# EAGLE design V2_SENSOR (EAGLE 6.4)
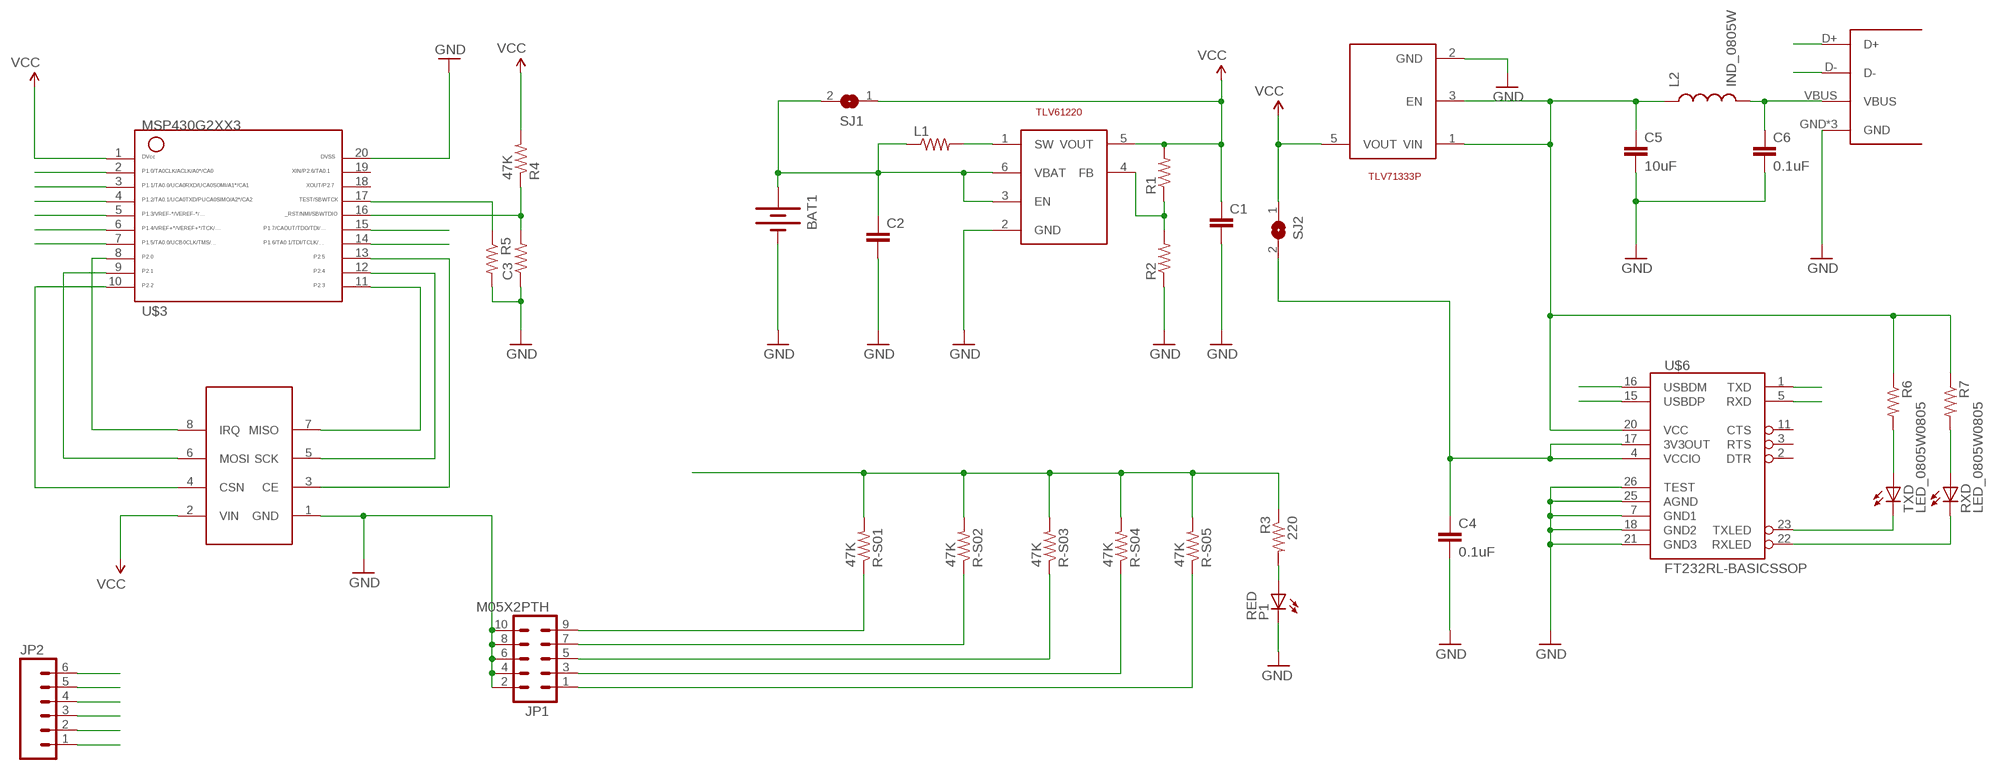
[diagram p0: schematic, sheet 1]

## Parts
BAT1  BATTERY20PTH  [BATTCOM_20MM_PTH]
C1  CAP_0805W  [0805W]
C2  CAP_0805W  [0805W]
C3  RES_0805W  [0805W]
C4  0.1uF  CAP_0805W  [0805W]
C5  10uF  CAP_0805W  [0805W]
C6  0.1uF  CAP_0805W  [0805W]
JP1  M05X2PTH  [AVR_ICSP]
JP2  M06SIP  [1X06]
JP4  USB-A-H  [USB-A-H]
L1  RES_0805W  [0805W]
L2  IND_0805W  [0805W]
P1  RED  LED_0805W0805  [0805W_LED]
R1  RES_0805W  [0805W]
R2  RES_0805W  [0805W]
R3  220  RES_0805W  [0805W]
R4  47K  RES_0805W  [0805W]
R5  RES_0805W  [0805W]
R6  RES_0805W  [0805W]
R7  RES_0805W  [0805W]
R-S01  47K  RES_0805W  [0805W]
R-S02  47K  RES_0805W  [0805W]
R-S03  47K  RES_0805W  [0805W]
R-S04  47K  RES_0805W  [0805W]
R-S05  47K  RES_0805W  [0805W]
RXD  LED_0805W0805  [0805W_LED]
SJ1  SJ  [SJ]
SJ2  SJ  [SJ]
TXD  LED_0805W0805  [0805W_LED]
U1  NRF24L01-4X2  [NRF24L01-4X2]
U$2  TLV61220  TI-TLV61220  [SOT23-6L]
U$3  G2XX3---N20  [N20]
U$5  TI-TLV71333P  [SOT23-5]
U$6  FT232RL-BASICSSOP  [SSOP28DB]

## Nets
5V: C5.1 L2.1 R6.1 R7.1 U$5.1(VIN) U$5.3(EN) U$6.20(VCC)
GND: BAT1.2(-) C1.2 C2.2 C3.1 C4.2 C5.2 C6.2 JP1.2 JP1.4 JP1.6 JP1.8 JP1.10 JP2.6 JP4.GND JP4.GND2(GND) JP4.GND3(GND) P1.C R2.1 R5.2 U1.1(GND) U$2.2(GND) U$3.20 U$5.2(GND) U$6.7(GND1) U$6.18(GND2) U$6.21(GND3) U$6.25(AGND) U$6.26(TEST)
N$1: R7.2 RXD.A
N$2: RXD.C U$6.22(RXLED)
N$3: C6.1 JP4.VBUS L2.2
N$4: TXD.C U$6.23(TXLED)
N$5: U1.8(IRQ) U$3.8
N$6: BAT1.1(+) C2.1 L1.1 SJ1.2 U$2.3(EN) U$2.6(VBAT)
N$7: C4.1 SJ2.2 U$6.4(VCCIO) U$6.17(3V3OUT)
N$10: R6.2 TXD.A
N$13: L1.2 U$2.1(SW)
N$14: R1.1 R2.2 U$2.4(FB)
N$15: P1.A R3.2
N$17: U1.3(CE) U$3.13
N$18: U1.5(SCK) U$3.12
N$19: U1.7(MISO) U$3.11
N$20: U1.6(MOSI) U$3.9
N$22: U1.4(CSN) U$3.10
RESET: C3.2 JP2.3 R4.1 U$3.16
RXD: JP2.5 U$3.3 U$6.1(TXD)
S1: JP1.9 R-S01.1 U$3.5
S2: JP1.7 R-S02.1 U$3.6
S3: JP1.5 R-S03.1 U$3.7
S4: JP1.3 R-S04.1 U$3.14
S5: JP1.1 R-S05.1 U$3.15
SV: R3.1 R-S01.2 R-S02.2 R-S03.2 R-S04.2 R-S05.2 U$3.2
TEST: JP2.2 R5.1 U$3.17
TXD: JP2.4 U$3.4 U$6.5(RXD)
USBDM: JP4.D- U$6.16(USBDM)
USBDP: JP4.D+ U$6.15(USBDP)
VCC: C1.1 JP2.1 R1.2 R4.2 SJ1.1 SJ2.1 U1.2(VIN) U$2.5(VOUT) U$3.1 U$5.5(VOUT)
Unconnected: U$3.18 U$3.19 U$6.2(DTR) U$6.3(RTS) U$6.11(CTS)

## Library data of the parts
BAT1 = SparkFun-Electromechanical:BATTERY: Battery Holders Various common sizes : AA, AAA, 20mm coin cell and 12mm coin cell. 20MM_4LEGS, BATT-10373
C1 C2 C4-C6 = custom:CAP_0805W
C3 L1 R1-R7 R-S01-R-S05 = custom:RES_0805W
JP1 = SparkFun-Connectors:M05X2: Header 5x2 Standard 10-pin dual row 0.1" header. Commonly used with AVR-ISP. Use with Spark Fun Electronics SKU: PRT-00778
JP2 = SparkFun-Connectors:M06: Header 6 Standard 6-pin 0.1" header. Use with straight break away headers (SKU : PRT-00116), right angle break away headers (PRT-00553), swiss pins (PRT-00743), machine pins (PRT-00117), and female headers (PRT-00115). Molex polarized connector foot print use with SKU : PRT-08094 with associated crimp pins and housings. NOTES ON THE VARIANTS LOCK and LOCK_LONGPADS... This footprint was designed to help hold the alignment of a through-hole component (i.e. 6-pin header) while soldering it into place. You may notice that each hole has been shifted either up or down by 0.005 of an inch from it's more standard position (which is a perfectly straight line). This slight alteration caused the pins (the squares in the middle) to touch the edges of the holes. Because they are alternating, it causes a "brace" to hold the component in place. 0.005 has proven to be the perfect amount of "off-center" position when using our standard breakaway headers. Although looks a little odd when you look at the bare footprint, once you have a header in there, the alteration is very hard to notice. Also, if you push a header all the way into place, it is covered up entirely on the bottom side. This idea of altering the position of holes to aid alignment will be further integrated into the Sparkfun Library for other footprints. It can help hold any component with 3 or more connection pins.
JP4 = custom:USB-A-H
L2 = custom:IND_0805W
P1 RXD TXD = custom:LED_0805W: SMD LEDs 0603- DIO 0805- DIO 1206- DIO
SJ1 SJ2 = jumper:SJ: SMD solder JUMPER
U1 = custom:NRF24L01-4X2
U$2 = custom:TI-TLV61220
U$3 = TI_MSP430_v16:G2XX3---N20: MSP430G2XX1 PDIP (N) 20 Pin Package
U$5 = custom:TI-TLV71333P
U$6 = SparkFun-DigitalIC:FT232RL-BASIC: USB UART This is the simplified version of the FT232RL unit. Only what you need, nothing you don't. Spark Fun Electronics SKU : COM-00650

## Board
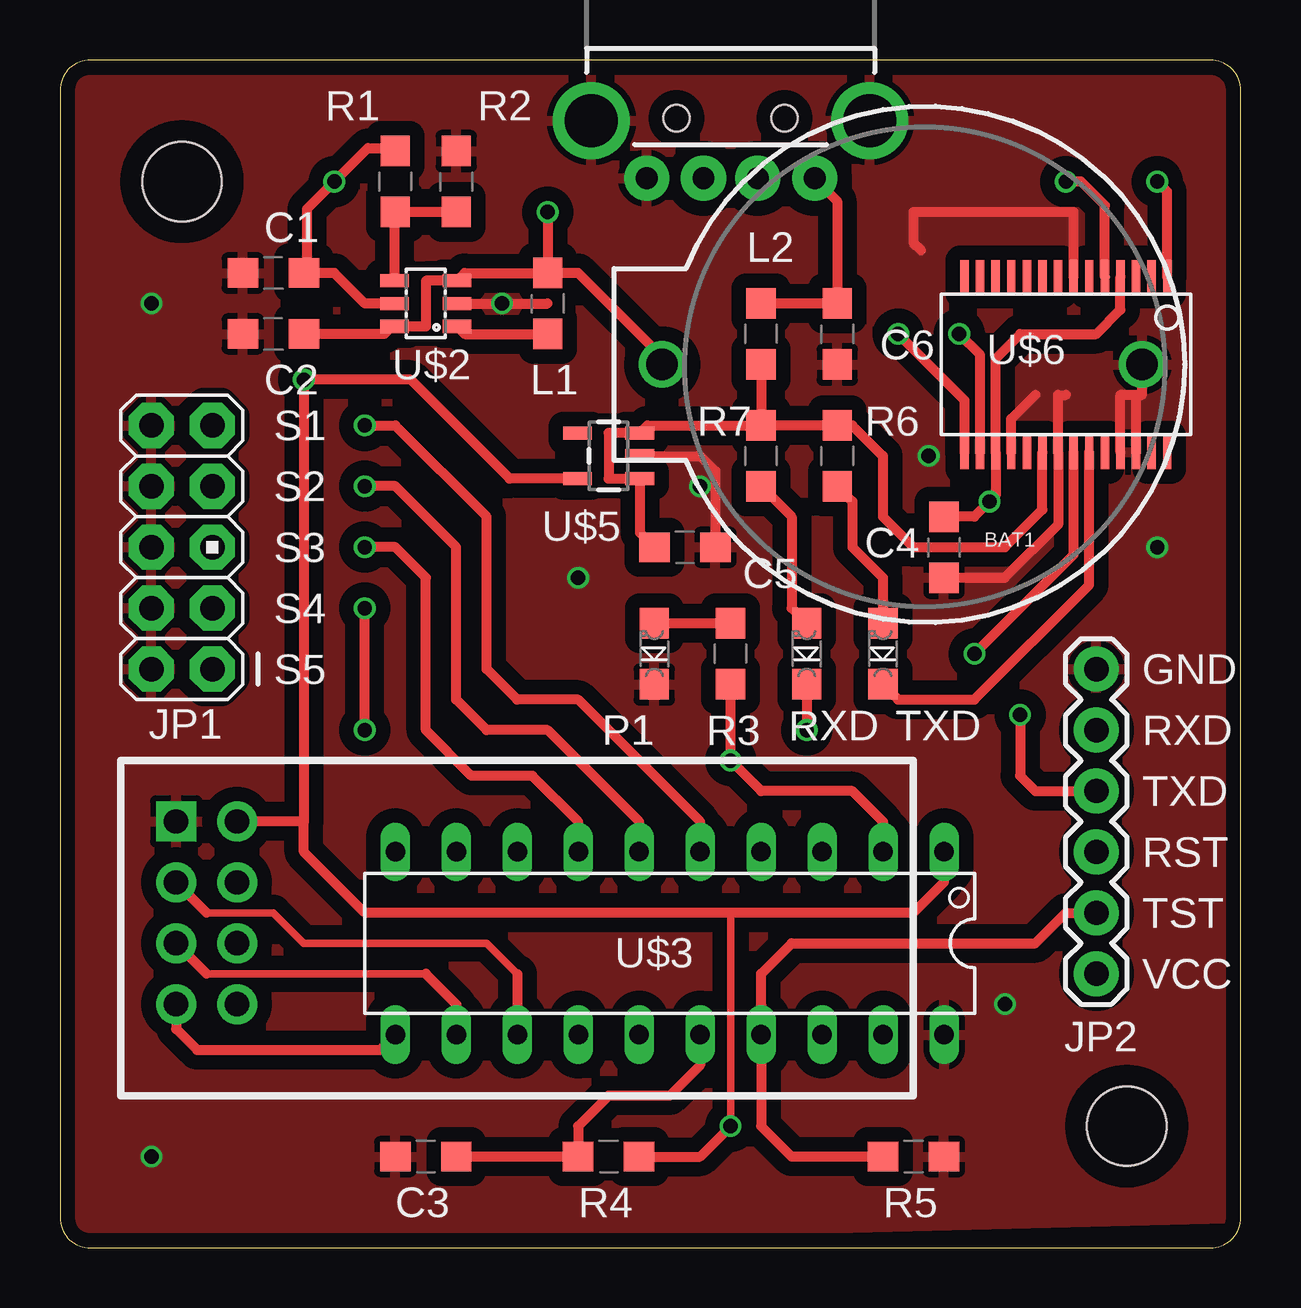
[diagram p1: board, top side]
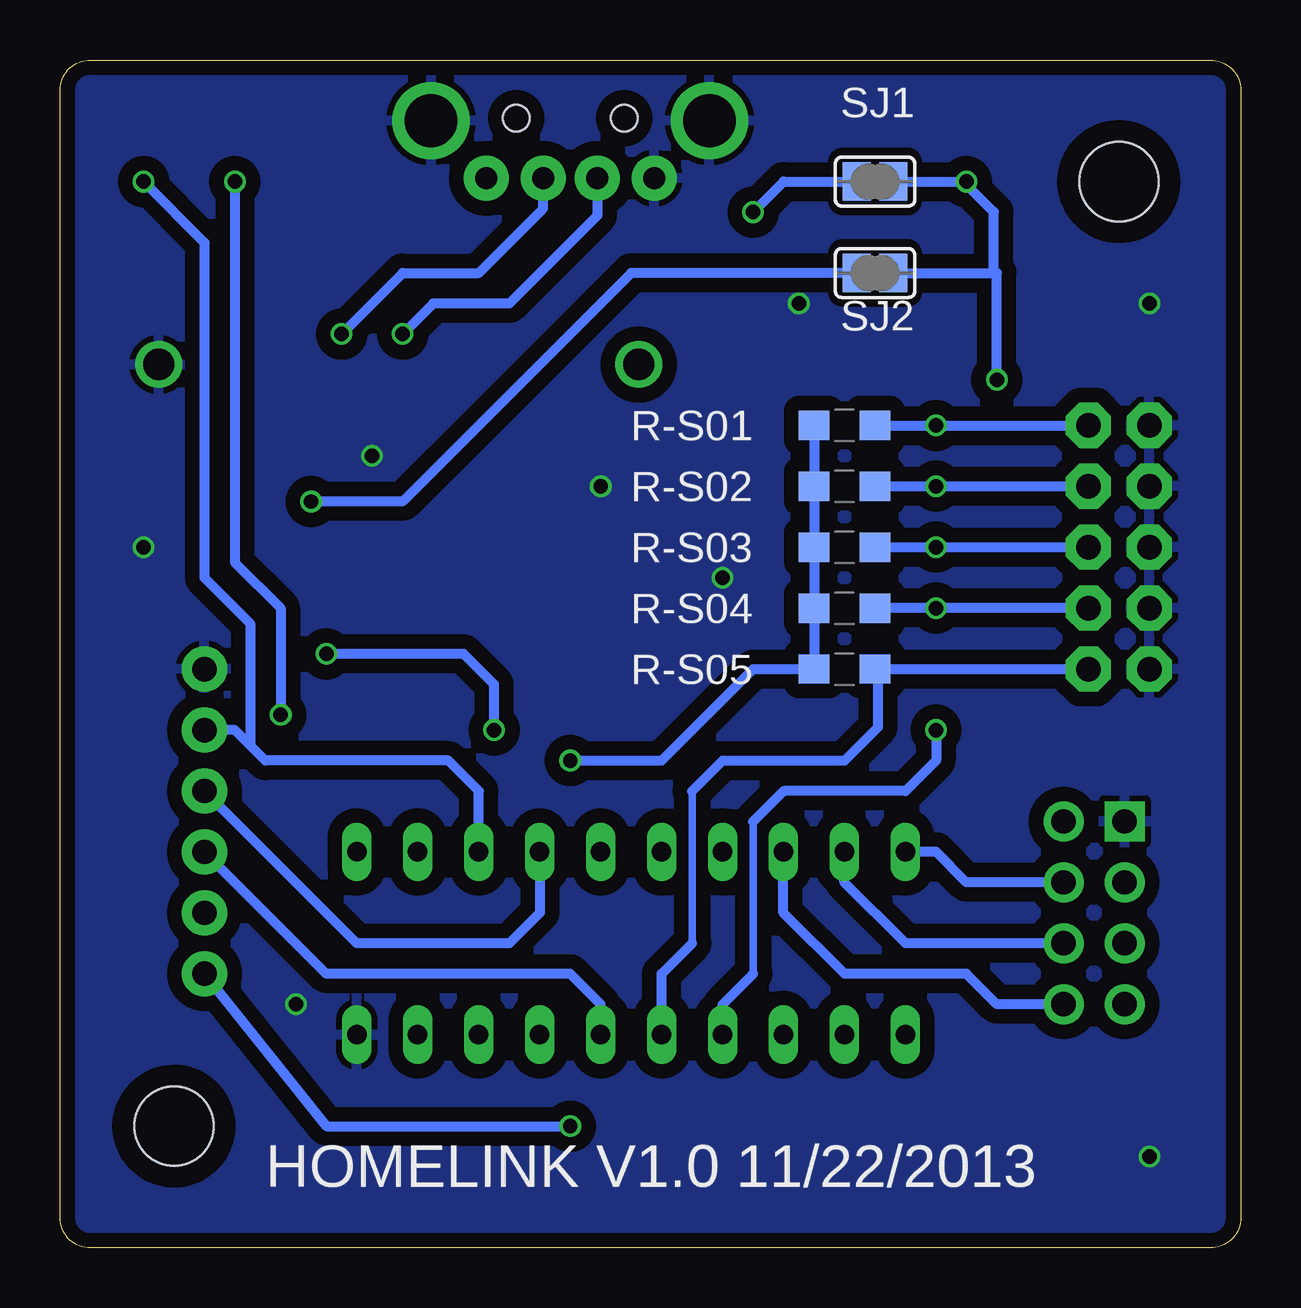
[diagram p2: board, bottom side, seen from below]

Size 49.2 x 49.52 mm. Coordinates in mm from the lower left corner, seen from the top.
Outline: 0,48.25 0,1.27 arc90 1.27,0 47.93,0 arc90 49.2,1.27 49.2,48.25 arc90 47.93,49.52 1.27,49.52 arc90 0,48.25
Copper layers (1*2*15*16): Top 0.035mm / dielectric 0.2mm / layer 2 0.0175mm / dielectric 1.1mm / layer 15 0.0175mm / dielectric 0.2mm / Bottom 0.035mm
Design rules "SeeedStudio_DRU_no_angle_20130527": minimum track width 6mil, minimum drill 12mil, track to track 6mil, track to pad 6mil, pad to pad 6mil, via to via 6mil, smd to smd 0mil, copper to edge 10mil, drill to drill 10mil, minimum pad ring 6mil, minimum via ring 6mil, stop-mask expansion 2mil, vias tented up to drill 25mil, thermal gap 10mil

### Footprints (pad centres in the part's own frame; a part is rotated, then mirrored left to right if it is on the bottom)
BATTCOM_20MM_PTH = drill 1.3: 1 20,0; 2 0,0
0805W = smd 1.27 x 1.219: 1 -1.27,0; 2 1.27,0
AVR_ICSP = drill 1.016 pad 1.88 octagon: 1 -1.27,5.08; 2 1.27,5.08; 3 -1.27,2.54; 4 1.27,2.54; 5 -1.27,0; 6 1.27,0; 7 -1.27,-2.54; 8 1.27,-2.54; 9 -1.27,-5.08; 10 1.27,-5.08
1X06 = drill 1.016 pad 1.88: 1 0,0; 2 2.54,0; 3 5.08,0; 4 7.62,0; 5 10.16,0; 6 12.7,0
USB-A-H = drill 0.914 pad 1.88: D+ 2.4,-1.127; D- 2.4,1.127; GND 2.4,-3.5; VBUS 2.4,3.5 | drill 2.2: GND2 0,-5.8; GND3 0,5.8 | hole 1.1: -0.1,2.25; -0.1,-2.25
0805W_LED = smd 1.27 x 1.219: A -1.27,0; C 1.27,0
SJ = smd 1.168 x 1.6: 1 -0.762,0; 2 0.762,0
NRF24L01-4X2 = drill 1.016 pad 1.676 square: 1 -11.67,3.81 | drill 1.016 pad 1.676: 2 -9.13,3.81; 3 -11.67,1.27; 4 -9.13,1.27; 5 -11.67,-1.27; 6 -9.13,-1.27; 7 -11.67,-3.81; 8 -9.13,-3.81
STAND-OFF = hole 3.302: 0,0
SOT23-6L = smd 0.55 x 1.2: 1 -0.95,-1.3; 2 0,-1.3; 3 0.95,-1.3; 4 0.95,1.3; 5 0,1.3; 6 -0.95,1.3
N20 = drill 0.813 long: 1 -11.435,-3.81; 2 -8.895,-3.81; 3 -6.355,-3.81; 4 -3.815,-3.81; 5 -1.275,-3.81; 6 1.265,-3.81; 7 3.805,-3.81; 8 6.345,-3.81; 9 8.885,-3.81; 10 11.425,-3.81; 11 11.425,3.81; 12 8.885,3.81; 13 6.345,3.81; 14 3.805,3.81; 15 1.265,3.81; 16 -1.275,3.81; 17 -3.815,3.81; 18 -6.355,3.81; 19 -8.895,3.81; 20 -11.435,3.81
SOT23-5 = smd 0.55 x 1.2: 1 -0.95,-1.3; 2 0,-1.3; 3 0.95,-1.3; 4 0.95,1.3; 5 -0.95,1.3
SSOP28DB = smd 0.348 x 1.397: 1 -4.225,-3.656; 2 -3.575,-3.656; 3 -2.925,-3.656; 4 -2.275,-3.656; 5 -1.625,-3.656; 6 -0.975,-3.656; 7 -0.325,-3.656; 8 0.325,-3.656; 9 0.975,-3.656; 10 1.625,-3.656; 11 2.275,-3.656; 12 2.925,-3.656; 13 3.575,-3.656; 14 4.225,-3.656; 15 4.225,3.656; 16 3.575,3.656; 17 2.925,3.656; 18 2.275,3.656; 19 1.625,3.656; 20 0.975,3.656; 21 0.325,3.656; 22 -0.325,3.656; 23 -0.975,3.656; 24 -1.625,3.656; 25 -2.275,3.656; 26 -2.925,3.656; 27 -3.575,3.656; 28 -4.225,3.656

### Placement (x,y rotation side)
BAT1  45.09,36.83 180 top
C1  8.89,40.64 180 top
C2  8.89,38.1 180 top
C3  15.24,3.81 0 top
C4  36.83,29.21 270 top
C5  26.04,29.21 0 top
C6  32.38,38.1 270 top
JP1  5.08,29.21 180 top
JP2  43.18,11.43 90 top
JP4  27.94,46.99 270 top
L1  20.32,39.37 270 top
L2  29.21,38.1 90 top
P1  24.77,24.77 270 top
R1  13.97,44.45 90 top
R2  16.51,44.45 270 top
R3  27.94,24.77 90 top
R4  22.86,3.81 0 top
R5  35.56,3.81 0 top
R6  32.38,33.02 270 top
R7  29.21,33.02 270 top
R-S01  16.51,34.29 180 bottom
R-S02  16.51,31.75 180 bottom
R-S03  16.51,29.21 180 bottom
R-S04  16.51,26.67 180 bottom
R-S05  16.51,24.13 180 bottom
RXD  31.11,24.77 270 top
SJ1  15.24,44.45 180 bottom
SJ2  15.24,40.64 180 bottom
TXD  34.29,24.77 270 top
U1  16.51,13.97 0 top
U$1  [STAND-OFF]  5.08,44.45 0 top
U$2  15.24,39.37 90 top
U$3  25.4,12.7 180 top
U$4  [STAND-OFF]  44.45,5.08 0 top
U$5  22.86,33.02 90 top
U$6  41.91,36.83 180 top

### Tracks (layer width: path | path; a pad name or v marks a point on that pad's centre or on a via)
5V
  Top 0.406: C5.1 24.16,29.82 U$5.1 22.86,32.07 22.86,33.97 U$5.3 24.48,34.29 R7.1 | R7.1 R6.1 33.02,34.29 34.29,33.02 34.29,30.48 35.56,29.21 39.37,29.21 40.94,30.77 U$6.20 | L2.1 R7.1
GND  (via drill 0.6)
  Top 0.406: U$2.2 v18.41,39.37 20.32,39.37 | 35.88,41.59 35.56,41.91 35.56,43.18 42.23,43.18 U$6.7 | U$5.2 26.67,33.02 27.3,32.38 C5.2 | U$6.26 44.84,35.56 | 44.84,35.56 44.19,35.56 U$6.25 | 44.84,35.56 45.09,35.56 BAT1.2 | 37.47,27.94 39.37,27.94 41.59,30.16 U$6.21 41.59,35.56 41.91,35.56 | U$6.18 39.63,34.55 40.64,35.56
  other vias: 26.67,31.75 36.2,33.02 21.59,27.94 3.81,39.37 3.81,3.81 39.37,10.16 45.72,29.21
  pour Top (isolate 0.61): 0,0 49.53,1.27 49.53,49.53 0,49.53
  pour Bottom (isolate 0.61): 0,49.53 49.53,49.53 49.53,0 0,0
N$1
  Top 0.406: R7.2 30.48,30.48 30.48,26.67 RXD.A
N$2  (via drill 0.6)
  Top 0.406: RXD.C v31.11,21.59 | v38.1,24.77 42.23,28.9 U$6.22
  Bottom 0.406: v38.1,24.77 32.38,24.77 RXD.C v31.11,21.59
N$3
  Top 0.406: JP4.VBUS 32.38,43.65 C6.1 L2.2
N$4
  Top 0.406: TXD.C 34.92,22.86 38.1,22.86 42.88,27.64 U$6.23
N$5
  Bottom 0.406: U1.8 10.16,10.16 11.43,11.43 16.51,11.43 19.05,13.97 U$3.8
N$6  (via drill 0.6)
  Top 0.406: U$2.3 16.19,40.32 | U$2.3 15.24,40.32 15.24,38.42 U$2.6 13.89,38.47 13.52,38.1 C2.1 | U$2.3 16.86,40.64 L1.1 | BAT1.1 25.09,37.15 21.59,40.64 L1.1 | v20.32,43.18 L1.1
  Bottom 0.406: v20.32,43.18 19.05,44.45 SJ1.2
N$7  (via drill 0.6)
  Top 0.406: U$6.4 44.19,39.1 43.18,38.1 40.01,38.1 38.98,37.08 U$6.17 38.98,31.36 v38.73,31.11 38.1,30.48 C4.1
  Bottom 0.406: SJ2.2 25.4,40.64 34.92,31.11 v38.73,31.11
N$10
  Top 0.406: R6.2 33.02,31.11 33.02,29.21 34.29,27.94 TXD.A
N$13
  Top 0.406: 16.59,38.47 U$2.1 16.86,38.1 L1.2
N$14
  Top 0.406: U$2.4 13.94,42.25 R1.1 R2.2
N$15
  Top 0.406: R3.2 P1.A
N$17
  Top 0.305: 6.11,13.97 8.89,13.97 10.16,12.7 17.78,12.7 19.05,11.43
  Top 0.406: U1.3 6.11,13.97 | 19.05,11.43 U$3.13
N$18
  Top 0.305: 6.11,11.43 15.24,11.43
  Top 0.406: U1.5 6.11,11.43 | 15.24,11.43 16.52,10.15 U$3.12
N$19
  Top 0.406: U1.7 4.84,9.13 5.72,8.25 13.34,8.25 U$3.11
N$20
  Bottom 0.406: U1.6 13.97,12.7 16.52,15.24 U$3.9
N$22
  Bottom 0.406: U1.4 11.43,15.24 12.7,16.51 U$3.10
RESET
  Top 0.406: C3.2 R4.1 21.59,4.03 21.59,5.08 22.86,6.35 25.4,6.35 26.67,7.62 U$3.16
  Bottom 0.406: U$3.16 26.67,10.16 27.94,11.43 38.1,11.43 JP2.3
RXD  (via drill 0.6)
  Top 0.406: U$6.1 46.13,44.03 v45.72,44.45
  Bottom 0.406: U$3.3 31.75,19.05 33.02,20.32 40.64,20.32 41.27,20.95 | 41.27,20.95 41.91,21.59 JP2.5 | v45.72,44.45 43.18,41.91 43.18,27.94 41.27,26.04 41.27,20.95
S1  (via drill 0.6)
  Top 0.406: U$3.5 26.67,17.78 21.59,22.86 19.05,22.86 17.78,24.13 17.78,30.48 13.97,34.29 v12.7,34.29
  Bottom 0.406: U$3.5 | R-S01.1 v12.7,34.29 JP1.9
S2  (via drill 0.6)
  Top 0.406: U$3.6 24.13,17.78 20.32,21.59 17.78,21.59 16.51,22.86 16.51,29.21 13.97,31.75 v12.7,31.75
  Bottom 0.406: R-S02.1 v12.7,31.75 JP1.7
S3  (via drill 0.6)
  Top 0.406: U$3.7 21.59,17.78 19.68,19.68 17.14,19.68 15.24,21.59 15.24,27.94 13.97,29.21 v12.7,29.21
  Bottom 0.406: R-S03.1 v12.7,29.21 JP1.5
S4  (via drill 0.6)
  Top 0.406: v12.7,21.59 v12.7,26.67
  Bottom 0.305: 20.32,11.43 20.32,17.78
  Bottom 0.406: U$3.14 21.59,10.15 20.32,11.43 | JP1.3 v12.7,26.67 R-S04.1 | v12.7,21.59 12.7,20.32 13.97,19.05 19.05,19.05 20.32,17.78
S5
  Bottom 0.305: 22.86,12.7 22.86,19.05
  Bottom 0.406: U$3.15 24.13,11.43 22.86,12.7 | JP1.1 R-S05.1 arc90 15.11,24 15.11,21.72 16.51,20.32 21.59,20.32 22.86,19.05
SV  (via drill 0.6)
  Top 0.406: U$3.2 34.29,17.78 33.02,19.05 29.21,19.05 v27.94,20.32 R3.1
  Bottom 0.406: U$3.2 | v27.94,20.32 24.13,20.32 20.32,24.13 R-S05.2 R-S04.2 R-S03.2 R-S02.2 R-S01.2
TEST
  Top 0.406: R5.1 30.48,3.81 29.21,5.08 U$3.17 29.21,10.16 29.21,10.17 29.21,11.43 30.48,12.7 40.64,12.7 41.91,13.97 JP2.2
  Bottom 0.406: U$3.17
TXD  (via drill 0.6)
  Top 0.406: U$6.5 43.53,43.46 42.55,44.45 v41.91,44.45 | v40.01,22.23 40.01,19.68 40.64,19.05 JP2.4
  Bottom 0.406: U$3.4 29.21,13.97 30.48,12.7 36.83,12.7 JP2.4 | v41.91,44.45 41.91,28.57 40.01,26.67 v40.01,22.23
USBDM  (via drill 0.6)
  Top 0.406: U$6.16 38.34,37.23 v37.47,38.1
  Bottom 0.406: v37.47,38.1 34.92,40.64 31.75,40.64 29.07,43.32 JP4.D-
USBDP  (via drill 0.6)
  Top 0.406: 37.69,34.7 U$6.15 37.69,35.34 v34.92,38.1
  Bottom 0.406: JP4.D+ 26.81,43.04 30.48,39.37 33.66,39.37 v34.92,38.1
VCC  (via drill 0.6)
  Top 0.305: v27.94,5.08 27.94,13.97
  Top 0.406: U$3.1 36.83,15.24 35.56,13.97 27.94,13.97 12.7,13.97 10.16,16.51 10.16,17.78 | R4.2 26.67,3.81 v27.94,5.08 | 10.16,17.78 U1.2 | U$2.5 12.7,39.37 11.43,40.64 C1.1 10.29,40.77 10.29,43.31 v11.43,44.45 12.83,45.85 13.84,45.85 R1.2 arc90 13.75,45.72 | 10.16,17.78 v10.16,36.2 14.61,36.2 18.73,32.07 U$5.5
  Bottom 0.406: JP2.1 38.1,5.08 v27.94,5.08 | v10.16,36.2 C1.1 | SJ1.1 v11.43,44.45 11.43,44.32 10.29,43.18 10.29,40.77 C1.1 | SJ2.1 C1.1

### Text on the board
tNames: S1 | S2 | S3 | S4 | S5 | GND | RXD | TXD | RST | TST | VCC
bNames: HOMELINK V1.0 11/22/2013